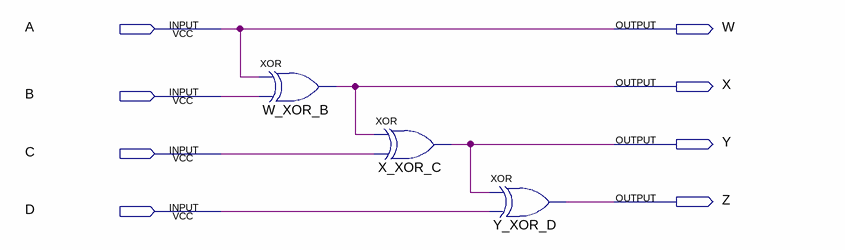
[diagram p0: schematic sheet]
// Quartus schematic Question1.bdf as structural Verilog: 3 symbols, 8 pins
module Question1 (
  input  A,
  input  B,
  input  C,
  input  D,
  output W,
  output X,
  output Y,
  output Z
);

  xor W_XOR_B (X, A, B);
  xor X_XOR_C (Y, X, C);
  xor Y_XOR_D (Z, Y, D);

  assign W = A;
endmodule
